# EAGLE design motor_tester (EAGLE 9.6.2)

## Sheet 1 of 2
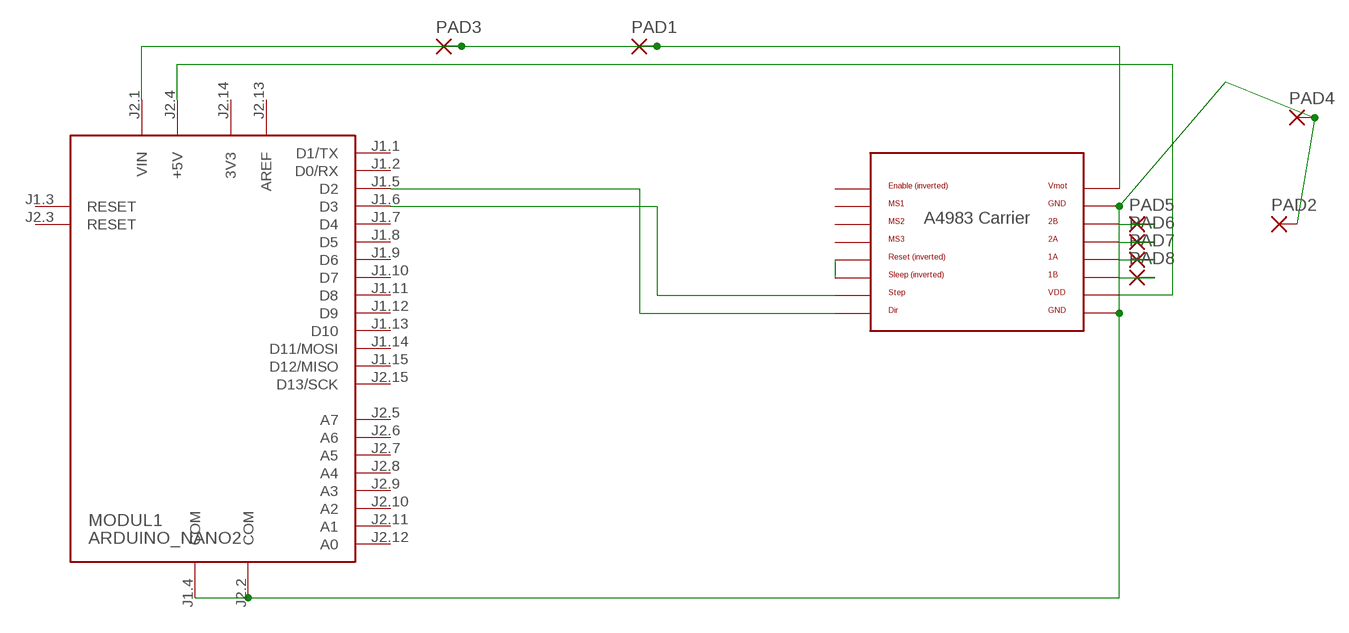
[diagram p0: schematic, sheet 1]

### Parts
MODUL1  ARDUINO_NANO2  [ARDUINO_NANO2]
PAD1  1,6/0,8  [1,6/0,8]
PAD2  1,6/0,8  [1,6/0,8]
PAD3  1,6/0,8  [1,6/0,8]
PAD4  1,6/0,8  [1,6/0,8]
PAD5  1,6/0,8  [1,6/0,8]
PAD6  1,6/0,8  [1,6/0,8]
PAD7  1,6/0,8  [1,6/0,8]
PAD8  1,6/0,8  [1,6/0,8]
U$6  POLOLU_A4983CARRIER  [A4983CARRIER]

### Nets
N$1 [WiderTraces]: MODUL1.J1.5(D2) U$6.DIR
N$2 [WiderTraces]: MODUL1.J1.6(D3) U$6.STEP
N$3 [WiderTraces]: MODUL1.J2.1(VIN) PAD1.1(P) PAD3.1(P) U$6.VMOT
N$5 [WiderTraces]: U$6.RST U$6.SLP(SLEEP)
N$6 [WiderTraces]: MODUL1.J1.4(COM) MODUL1.J2.2(COM) PAD2.1(P) PAD4.1(P) U$6.GND U$6.GND@0(GND)
N$7 [WiderTraces]: PAD5.1(P) U$6.2B
N$8 [WiderTraces]: PAD6.1(P) U$6.2A
N$9 [WiderTraces]: PAD7.1(P) U$6.1A
N$10 [WiderTraces]: PAD8.1(P) U$6.1B
N$11 [WiderTraces]: MODUL1.J2.4(+5V) U$6.VDD
Unconnected: MODUL1.J1.1(D1/TX) MODUL1.J1.2(D0/RX) MODUL1.J1.3(RESET) MODUL1.J1.7(D4) MODUL1.J1.8(D5) MODUL1.J1.9(D6) MODUL1.J1.10(D7) MODUL1.J1.11(D8) MODUL1.J1.12(D9) MODUL1.J1.13(D10) MODUL1.J1.14(D11/MOSI) MODUL1.J1.15(D12/MISO) MODUL1.J2.3(RESET) MODUL1.J2.5(A7) MODUL1.J2.6(A6) MODUL1.J2.7(A5) MODUL1.J2.8(A4) MODUL1.J2.9(A3) MODUL1.J2.10(A2) MODUL1.J2.11(A1) MODUL1.J2.12(A0) MODUL1.J2.15(D13/SCK) U$6.EN U$6.MS1 U$6.MS2 U$6.MS3

## Sheet 2 of 2

## Power pins joined to a net without a drawn wire
3V3: MODUL1.J2.14(3V3)
AREF: MODUL1.J2.13(AREF)

## Library data of the parts
MODUL1 = arduino:ARDUINO_NANO2: Arduino Nano2 Auto generated by modulcreator.ulp \;; ANZAHL: 2; MODUL: TRUE; STECKX0: -76200; STECKX1: 76200; STECKY0: 177800; STECKY1: 177800
PAD1-PAD8 = wirepad:1,6/0,8: THROUGH-HOLE PAD
U$6 = RepRapjr:POLOLU_A4983CARRIER

## Net classes
1 WiderTraces: width 1.27 mm

## Board
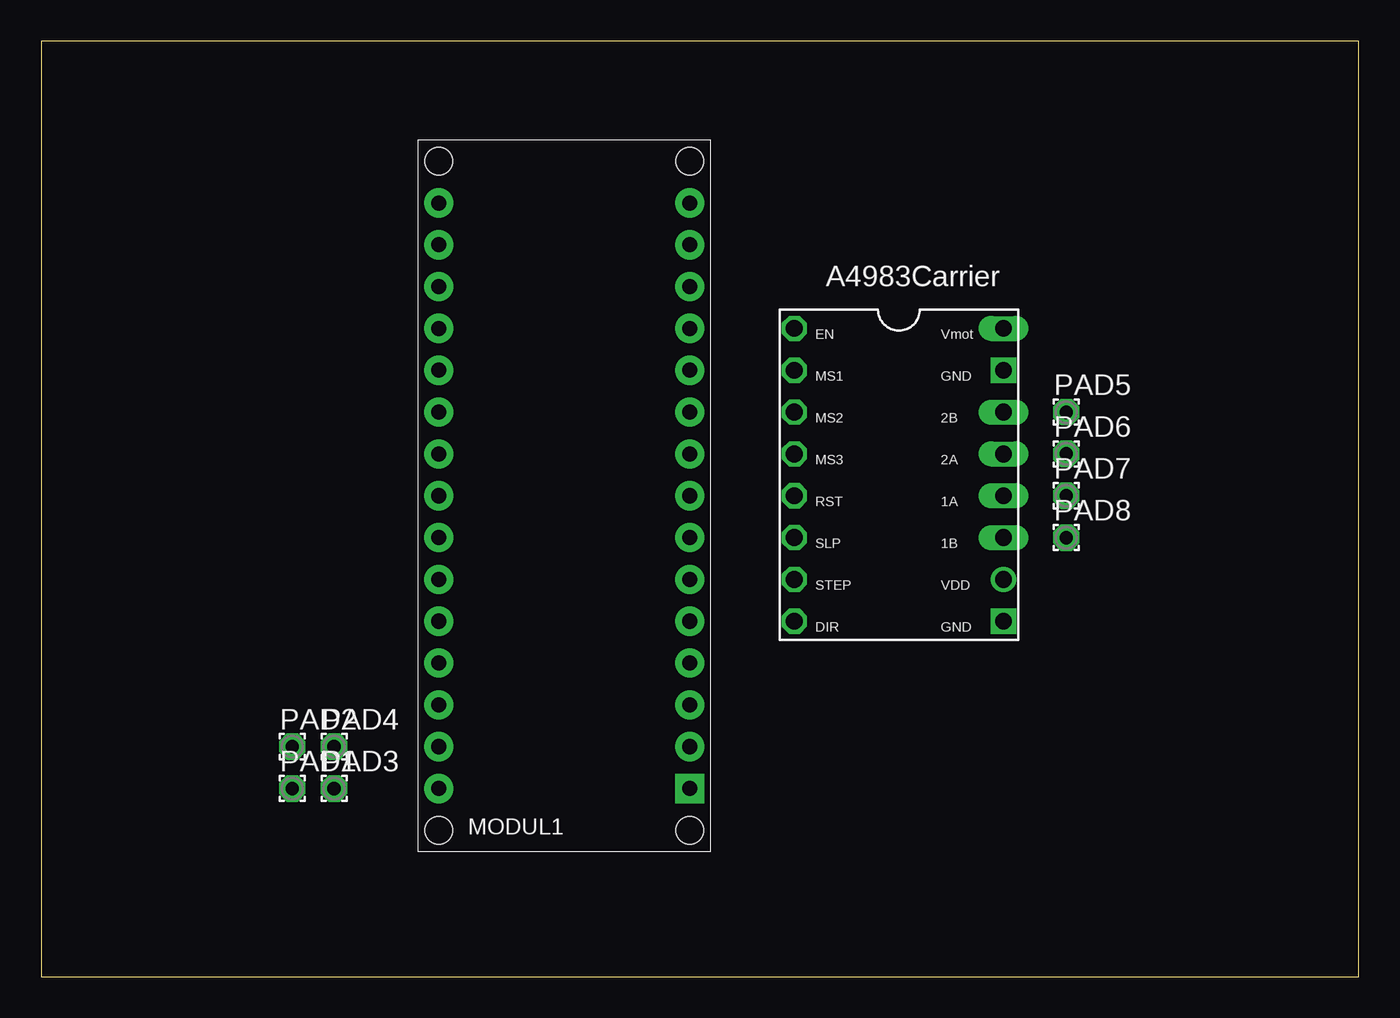
[diagram p1: board, top side]
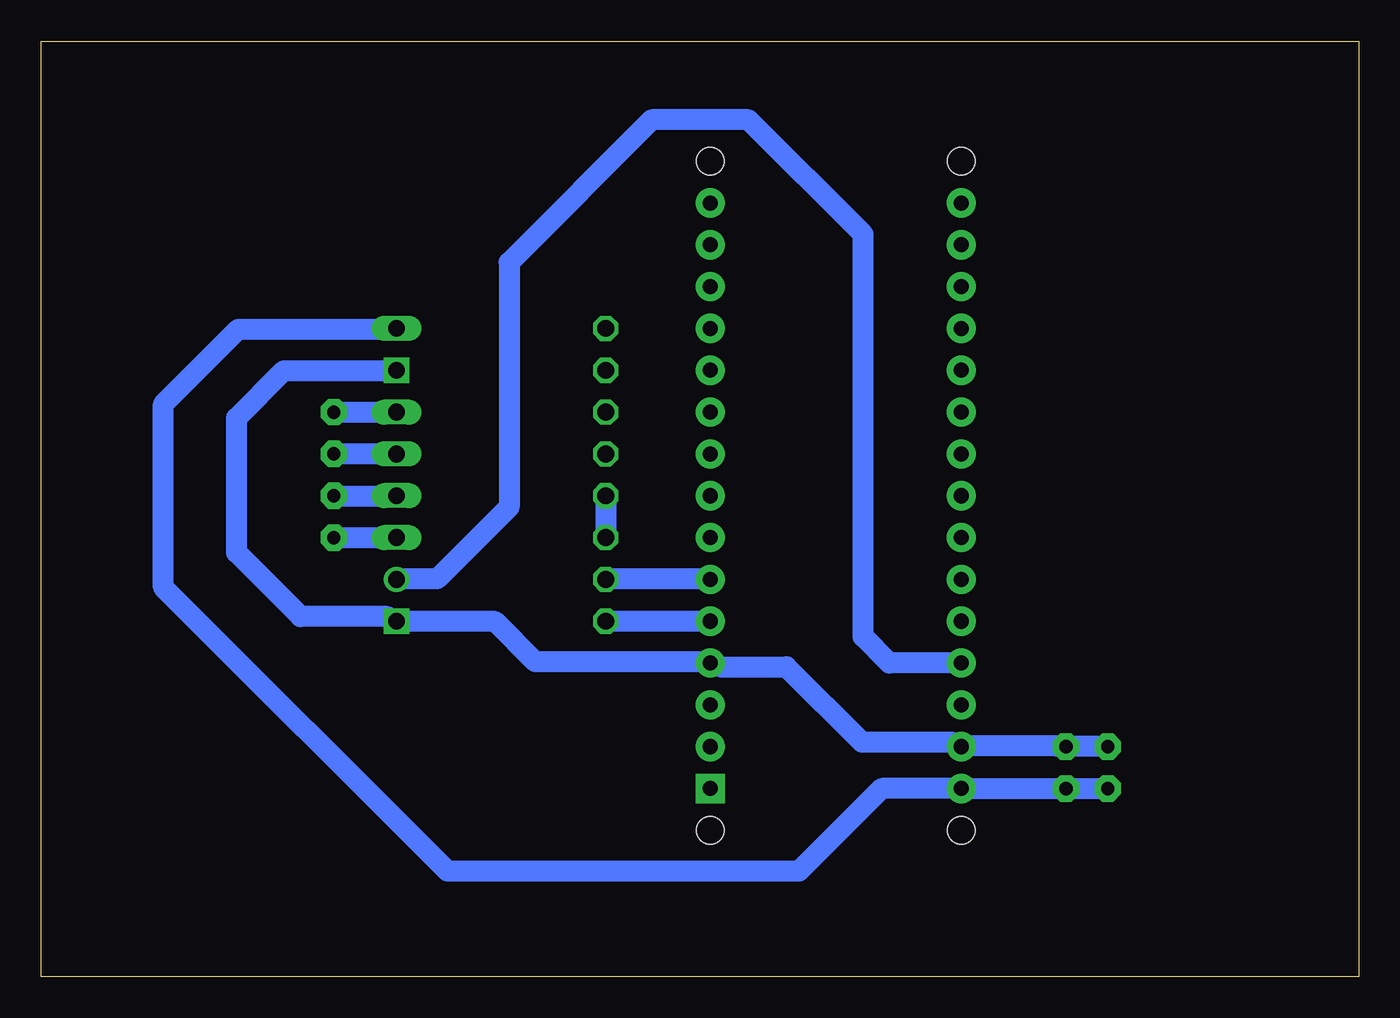
[diagram p2: board, bottom side, seen from below]

Size 79.99 x 56.82 mm. Coordinates in mm from the lower left corner, seen from the top.
Outline: 0,0 79.99,0 79.99,56.82 0,56.82 0,0
Copper layers (1*16): Top 0.035mm / dielectric 1.5mm / Bottom 0.035mm
Design rules "default": minimum track width 6mil, minimum drill 0.35mm, track to track 6mil, track to pad 6mil, pad to pad 6mil, via to via 6mil, smd to smd 6mil, copper to edge 40mil, drill to drill 6mil, minimum pad ring 10mil, minimum via ring 8mil, stop-mask expansion 4mil, vias tented up to drill 0mil, thermal gap 10mil

### Footprints (pad centres in the part's own frame; a part is rotated, then mirrored left to right if it is on the bottom)
ARDUINO_NANO2 = drill 0.914 pad 1.778 square: J1.1 -7.62,17.78 | drill 0.914 pad 1.778: J1.2 -7.62,15.24; J1.3 -7.62,12.7; J1.4 -7.62,10.16; J1.5 -7.62,7.62; J1.6 -7.62,5.08; J1.7 -7.62,2.54; J1.8 -7.62,0; J1.9 -7.62,-2.54; J1.10 -7.62,-5.08; J1.11 -7.62,-7.62; J1.12 -7.62,-10.16; J1.13 -7.62,-12.7; J1.14 -7.62,-15.24; J1.15 -7.62,-17.78; J2.1 7.62,17.78; J2.2 7.62,15.24; J2.3 7.62,12.7; J2.4 7.62,10.16; J2.5 7.62,7.62; J2.6 7.62,5.08; J2.7 7.62,2.54; J2.8 7.62,0; J2.9 7.62,-2.54; J2.10 7.62,-5.08; J2.11 7.62,-7.62; J2.12 7.62,-10.16; J2.13 7.62,-12.7; J2.14 7.62,-15.24; J2.15 7.62,-17.78 | hole 1.651: -7.62,-20.32; 7.62,-20.32; 7.62,20.32; -7.62,20.32
1,6/0,8 = drill 0.813 pad 1.6 octagon: 1 0,0
A4983CARRIER = drill 1.016 long: 1A 8.89,1.27; 1B 11.43,1.27; 2A 6.35,1.27; 2B 3.81,1.27; VMOT -1.27,1.27 | drill 1.016 octagon: DIR 16.51,-11.43; EN -1.27,-11.43; MS1 1.27,-11.43; MS2 3.81,-11.43; MS3 6.35,-11.43; RST 8.89,-11.43; SLP 11.43,-11.43; STEP 13.97,-11.43 | drill 1.016 square: GND 16.51,1.27; GND@0 1.27,1.27 | drill 1.016: VDD 13.97,1.27

### Placement (x,y rotation side)
MODUL1  31.75,29.21 180 top
PAD1  15.24,11.43 0 top
PAD2  15.24,13.97 0 top
PAD3  17.78,11.43 0 top
PAD4  17.78,13.97 0 top
PAD5  62.23,34.29 0 top
PAD6  62.23,31.75 0 top
PAD7  62.23,29.21 0 top
PAD8  62.23,26.67 0 top
U$6  57.15,38.1 270 top

### Tracks (layer width: path | path; a pad name or v marks a point on that pad's centre or on a via)
N$1
  Bottom 1.27: U$6.DIR 45.72,21.57 39.4,21.57 MODUL1.J1.5
N$2
  Bottom 1.27: U$6.STEP 45.72,24.16 39.4,24.16 MODUL1.J1.6
N$3
  Bottom 1.27: PAD1.1 PAD3.1 MODUL1.J2.1 28.96,11.43 33.98,6.4 55.32,6.4 72.57,23.65 72.57,34.77 68.02,39.32 58.45,39.32 U$6.VMOT
N$5
  Bottom 1.27: U$6.RST U$6.SLP
N$6
  Bottom 0.152: 39.42,19.1 MODUL1.J1.4
  Bottom 1.27: PAD2.1 15.24,14.02 17.75,14.02 PAD4.1 18.36,14.02 24.08,14.02 MODUL1.J2.2 24.69,14.25 30.18,14.25 34.75,18.82 38.79,18.82 MODUL1.J1.4 39.47,19.13 49.99,19.13 52.43,21.57 58.37,21.57 U$6.GND 58.98,21.87 64.24,21.87 68.12,25.76 68.12,33.93 65.25,36.8 58.45,36.8 U$6.GND@0
N$7
  Bottom 1.27: PAD5.1 U$6.2B
N$8
  Bottom 1.27: U$6.2A 58.45,31.77 62.18,31.77 PAD6.1
N$9
  Bottom 1.27: U$6.1A 58.45,29.18 62.18,29.18 PAD7.1
N$10
  Bottom 1.27: PAD8.1 U$6.1B
N$11
  Bottom 1.27: MODUL1.J2.4 28.5,19.05 30.1,20.65 30.1,45.09 37.06,52.05 42.93,52.05 51.59,43.38 51.59,28.52 55.96,24.16 58.37,24.16 U$6.VDD